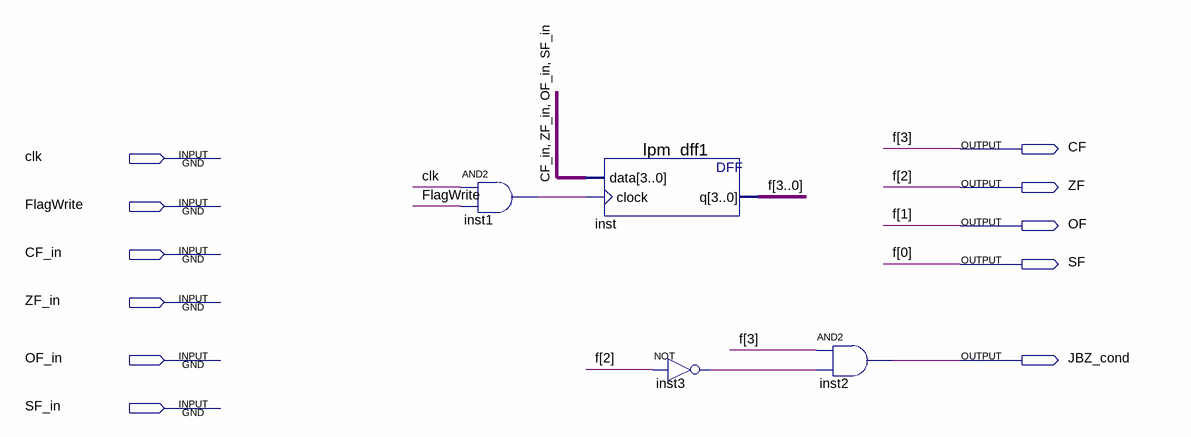
[diagram p0: schematic sheet]
// Quartus schematic regFlag.bdf as structural Verilog: 4 symbols, 11 pins
module regFlag (
  input  clk,
  input  FlagWrite,
  input  CF_in,
  input  ZF_in,
  input  OF_in,
  input  SF_in,
  output CF,
  output ZF,
  output OF,
  output SF,
  output JBZ_cond
);

  wire inst1_out, inst3_out;

  and inst1 (inst1_out, clk, FlagWrite);
  lpm_dff1 inst (.data({CF_in, ZF_in, OF_in, SF_in}), .clock(inst1_out), .q({CF, ZF, OF, SF}));
  not inst3 (inst3_out, ZF);
  and inst2 (JBZ_cond, CF, inst3_out);

  // Other names for the same wires on the sheet: f[3:0] = {CF, ZF, OF, SF}
endmodule
